# EAGLE board LARIX_V5.1 (EAGLE 6.5.0)
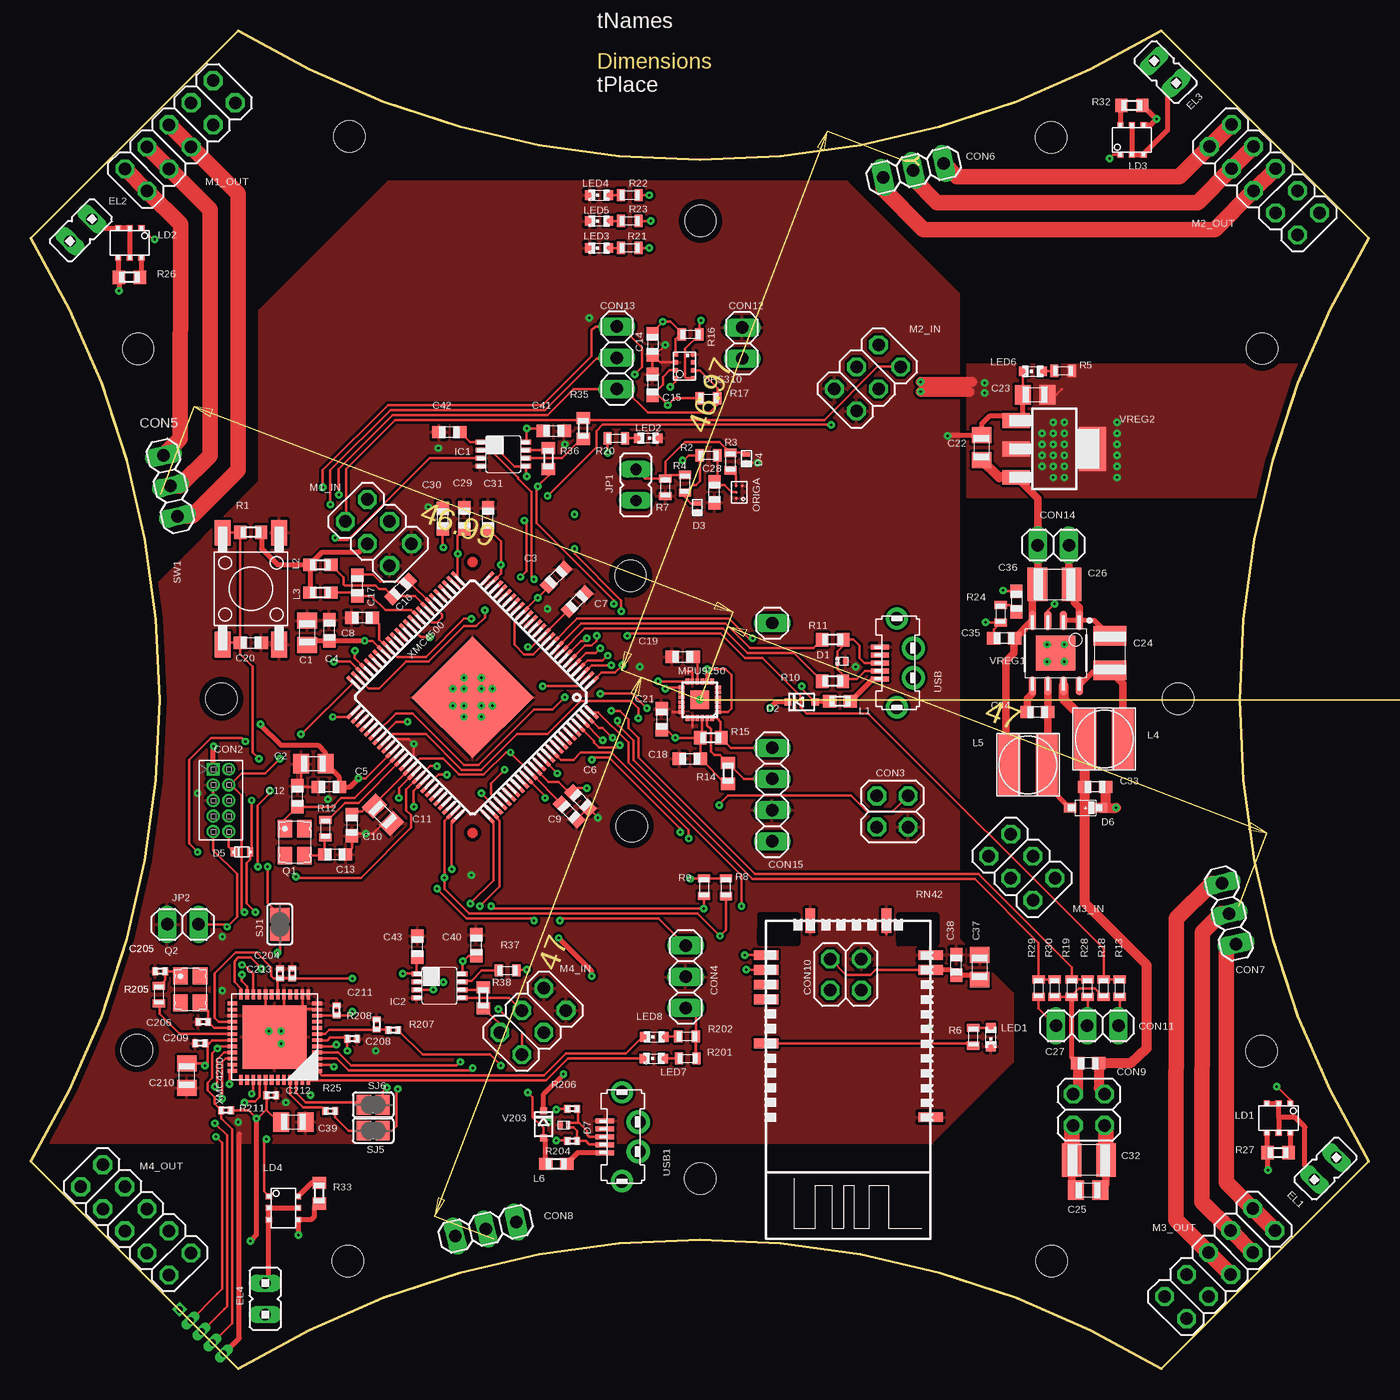
[diagram p3: board, top side]
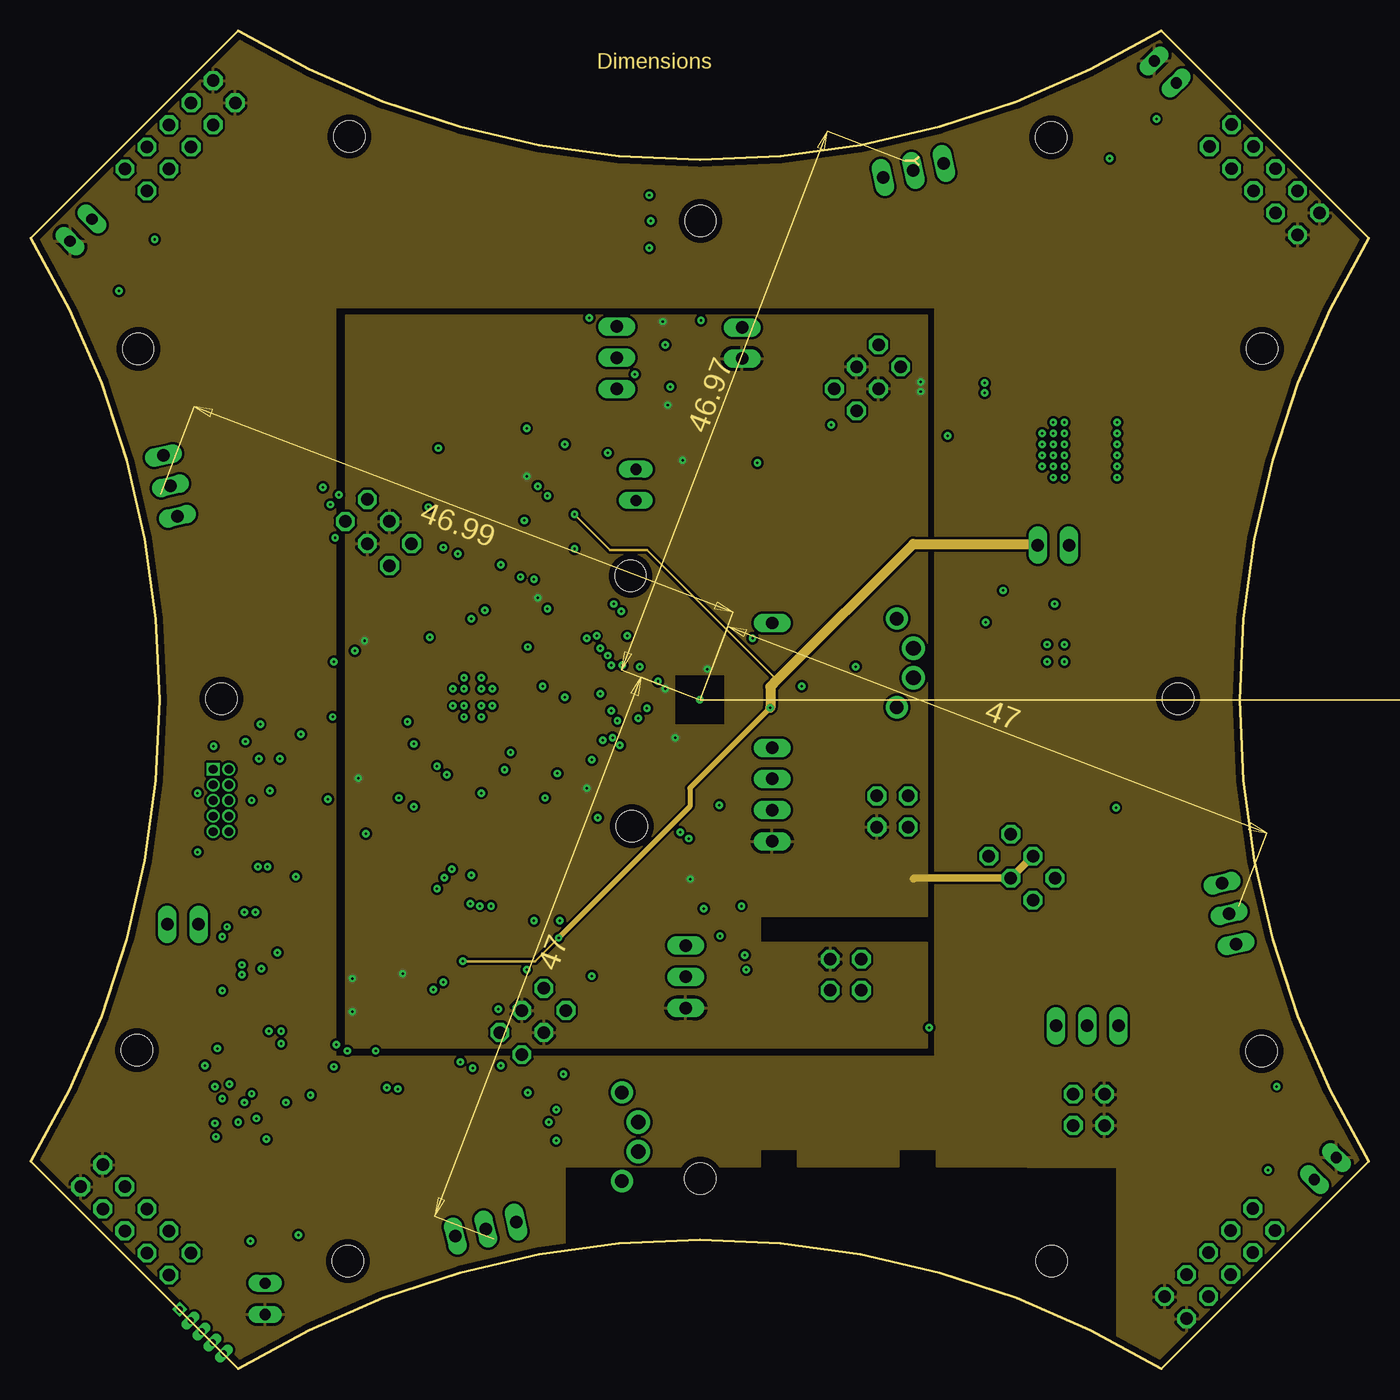
[diagram p4: board, inner layer VCC_VDD]
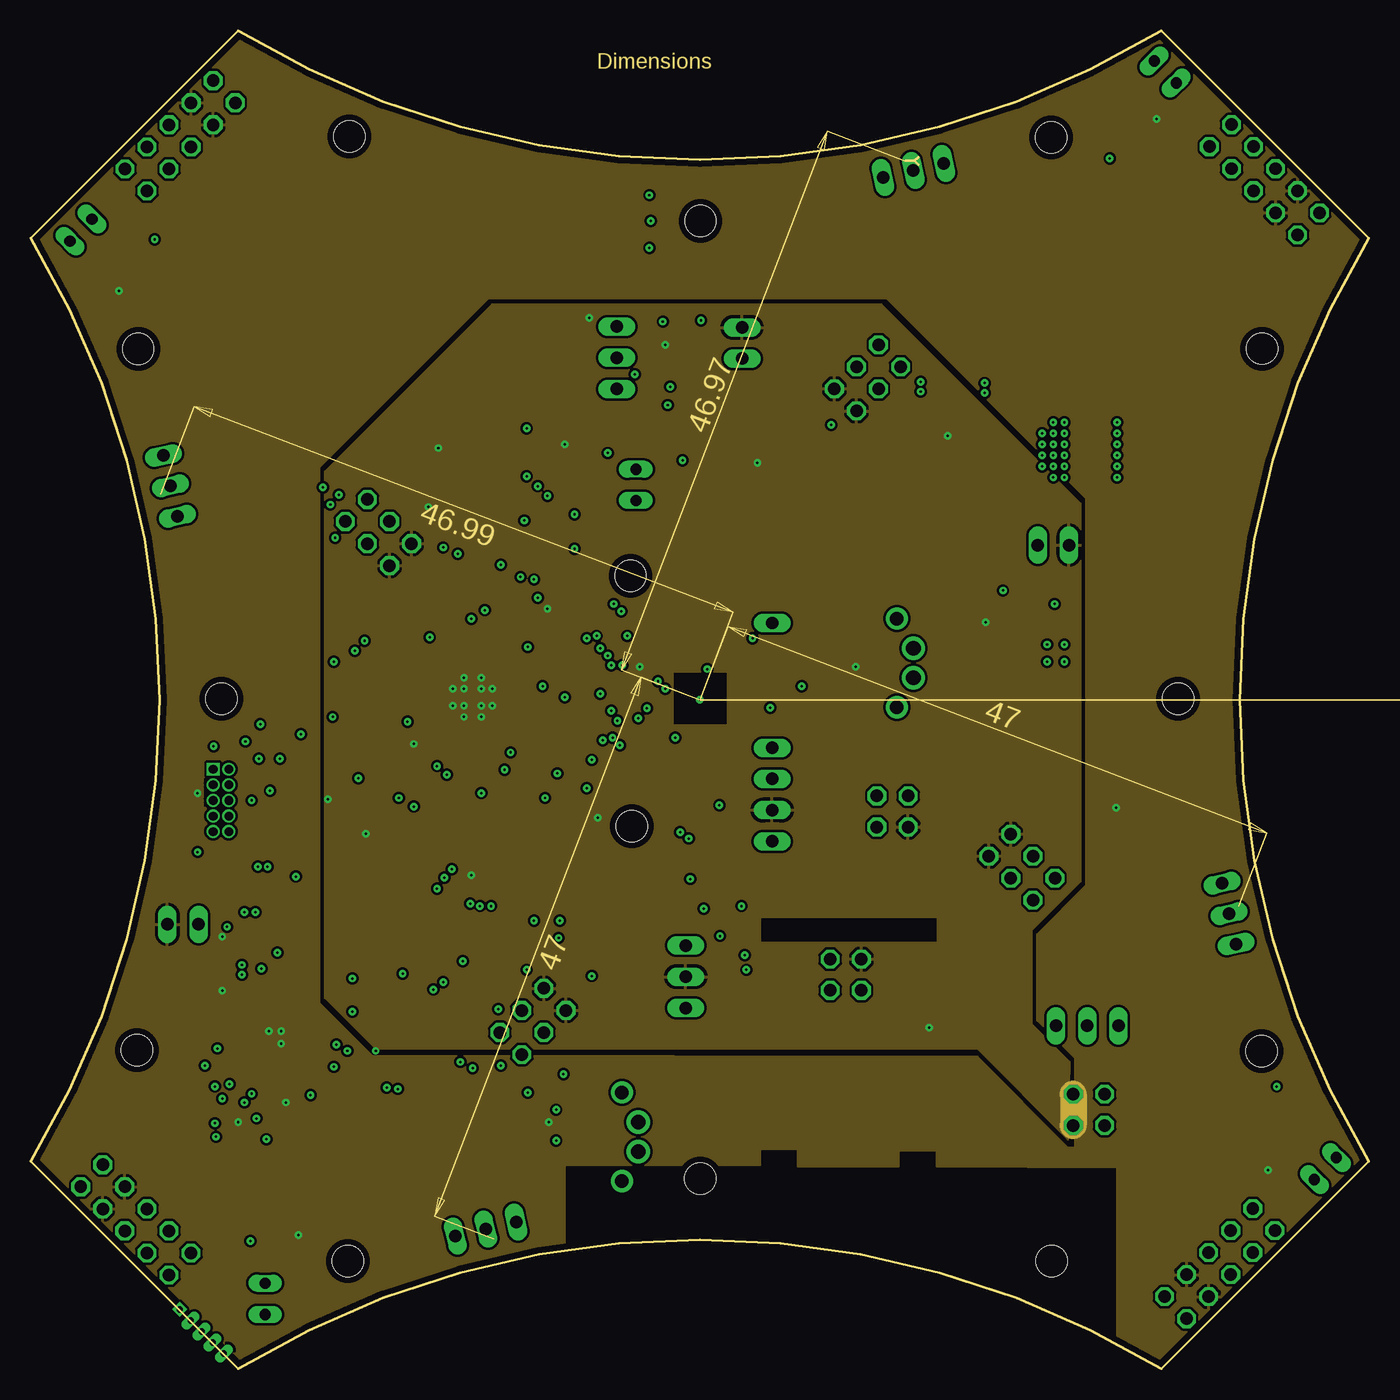
[diagram p5: board, inner layer PGND_DGND]
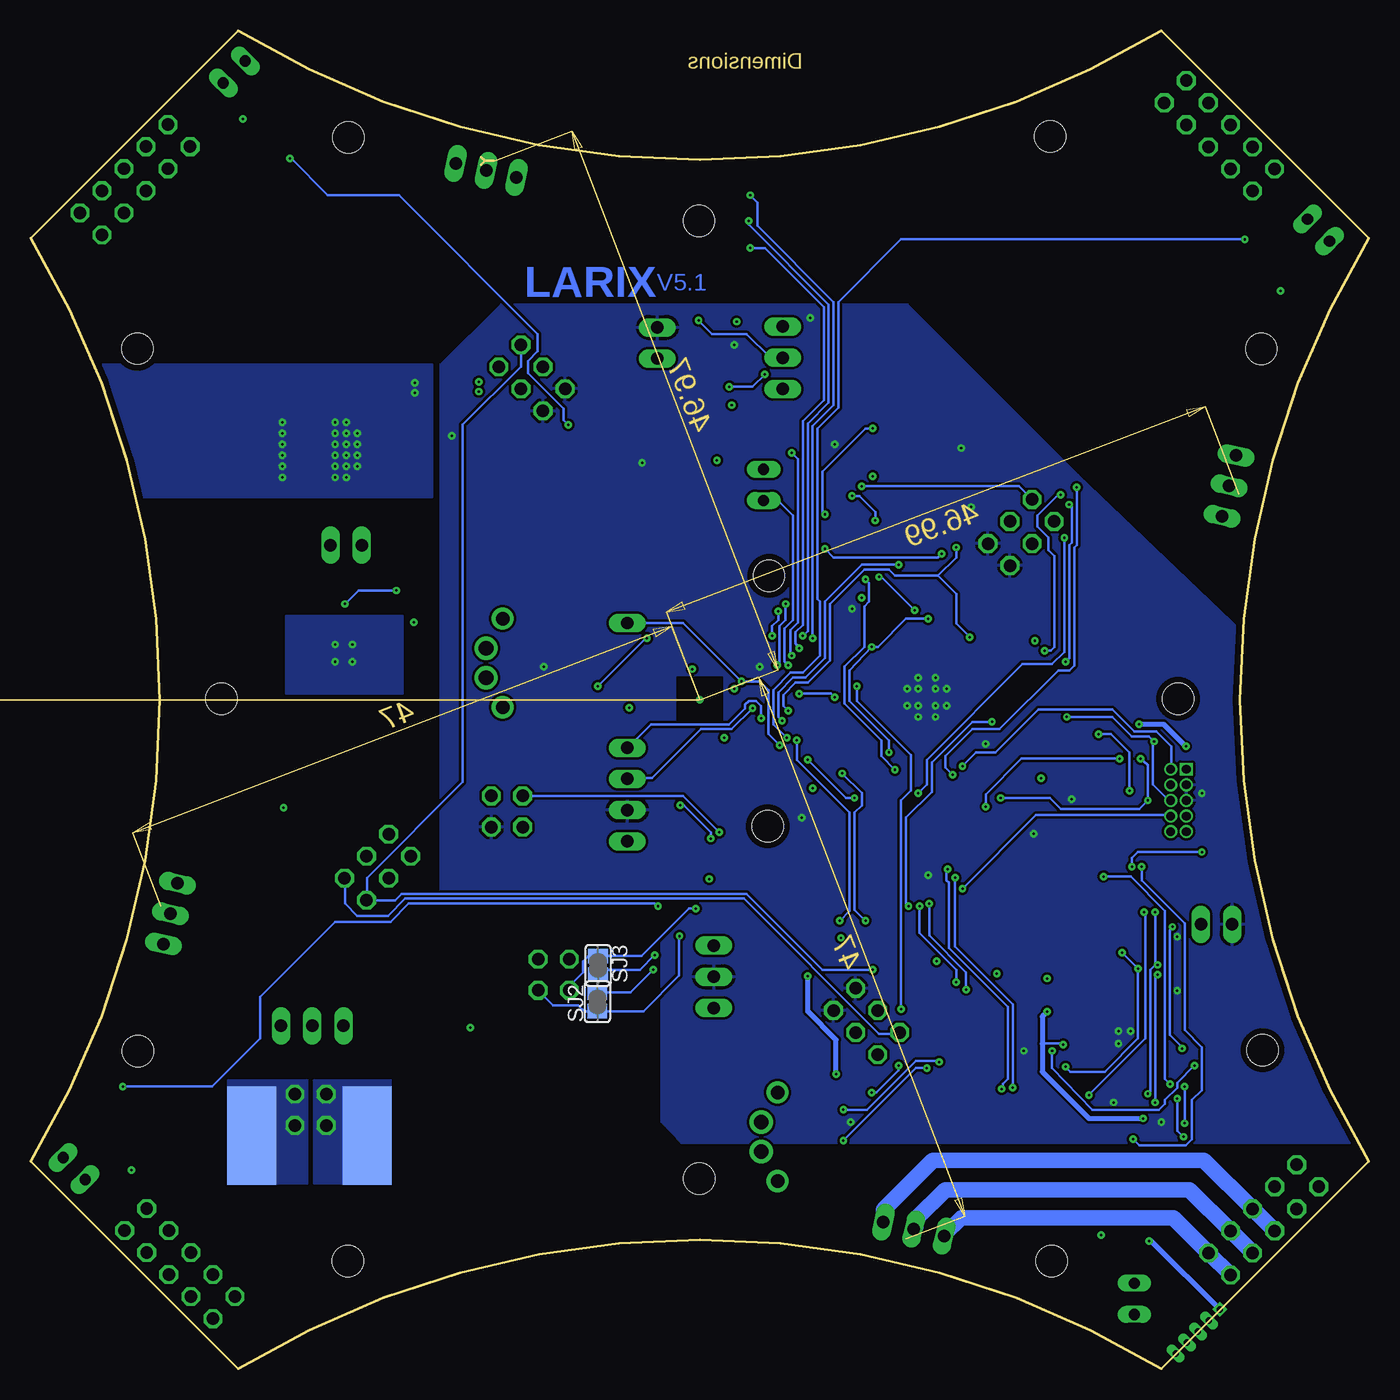
[diagram p6: board, bottom side, seen from below]

Size 109 x 109 mm. Coordinates in mm from the lower left corner, seen from the top.
Outline: 16.9,109 arc62 92.1,109 109,92.1 arc62 109,16.9 92.1,0 arc62 16.9,0 0,16.9 arc62 0,92.1 16.9,109
Copper layers (1+2*15+16): Top 0.035mm / dielectric 0.4mm / VCC_VDD 0.035mm / dielectric 0.71mm / PGND_DGND 0.035mm / dielectric 0.4mm / Bottom 0.035mm
Design rules "Hitzex_CPU_45A *": minimum track width 0.2mm, minimum drill 0.2mm, track to track 0.2mm, track to pad 0.2mm, pad to pad 0.2mm, via to via 0.2mm, smd to smd 0.2mm, copper to edge 0.5mm, drill to drill 0.5mm, minimum pad ring 7mil, minimum via ring 0.2mm, stop-mask expansion 4mil, vias tented up to drill 0.2mm, thermal gap 10mil
Holes 2.54 mm at 48.96,44.19 48.86,64.59 25.96,100.39 8.76,83.09 8.65,25.97 25.85,8.77 100.32,83.1 83.12,100.3 83.15,8.78 100.25,25.88 93.45,54.58 54.55,15.48 15.55,54.57 54.56,93.49
tRestrict: 8 lines
bRestrict: 4 lines
Milling: area 48.9,54.8 to 49.7,56.3; area 32.9,12.4 to 33.7,13.9; area 41.2,32.3 to 43.8,35.5; area 56.8,59.7 to 58.3,60.5; area 99.2,43.7 to 100.7,44.5; area 77.6,51.9 to 80.8,54.6; area 55.7,61.6 to 57.2,62.5; area 13.3,77.6 to 14.8,78.4; area 31.3,66.7 to 38.4,70.9; area 48.1,56.9 to 49,58.4; area 64.1,99.3 to 64.9,100.8; area 53.3,75.8 to 57.4,82.9; 19 lines

## Footprints (pad centres in the part's own frame; a part is rotated, then mirrored left to right if it is on the bottom)
C0805K = smd 1.3 x 1.6: 1 -1,0; 2 1,0
C0603 = smd 1.1 x 1: 1 -0.85,0; 2 0.85,0
C1210 = smd 1.6 x 2.7: 1 -1.4,0; 2 1.4,0
C0402 = smd 0.5 x 0.65: 1 -0.4,0; 2 0.4,0
FTSH-105-01-F-D-K = drill 0.7 pad 1.05 square: 1 -2.54,-0.635 | drill 0.7 pad 1.05: 2 -2.54,0.635; 3 -1.27,-0.635; 4 -1.27,0.635; 5 0,-0.635; 6 0,0.635; 7 1.27,-0.635; 8 1.27,0.635; 9 2.54,-0.635; 10 2.54,0.635
2X02 = drill 1.016 octagon: 1 -1.27,-1.27; 2 -1.27,1.27; 3 1.27,-1.27; 4 1.27,1.27
1X03 = drill 1.016 long: 1 -2.54,0; 2 0,0; 3 2.54,0
1X02 = drill 1.016 long: 1 -1.27,0; 2 1.27,0
1X10 = drill 1.016 long: 1 -11.43,0; 2 -8.89,0; 3 -6.35,0; 4 -3.81,0; 8 6.35,0
TSLP-3-1 = smd 0.225 x 0.35: 1 0.113,-0.475; 2 0.487,-0.475 | smd 0.6 x 0.35: 3 0.3,0.175
SOD323-R = smd 0.6 x 0.6: A 1.1,0; C -1.1,0
TSLP-2-20 = smd 0.6 x 0.35: P$1 0.1,0.4; P$2 0.1,-0.3
SC79 = smd 0.508 x 0.762: 1 -0.675,0; 2 0.675,0
INF-SOD323_V_1PRIMARY = smd 0.762 x 1.016: 1 0,1.25; 2 0,-1.25
LGA8R125P0X4_500X300X120 = smd 0.381 x 0.381: P1 0.725,0.975; P2 0.725,0.325; P3 0.725,-0.325; P4 0.725,-0.975; P5 -0.725,-0.975; P6 -0.725,-0.325; P7 -0.725,0.325; P8 -0.725,0.975
JP1 = drill 0.914 long: 1 0,-1.27; 2 0,1.27
DCT_R-PDSO-G8 = smd 0.4 x 0.8: 1 -0.975,-1.875; 2 -0.325,-1.875; 3 0.325,-1.875; 4 0.975,-1.875; 5 0.975,1.875; 6 0.325,1.875; 7 -0.325,1.875; 8 -0.975,1.875
L1608 = smd 1.1 x 1: 1 -0.85,0; 2 0.85,0
WE-TPC = smd 5.08 x 1.778: P$1 0,1.27; P$2 0,-1.778
SC74 = smd 0.5 x 0.5: P_1 -0.05,-2.2; P_2 0.9,-2.2; P_3 1.85,-2.2; P_4 1.85,0.2; P_5 0.9,0.2; P_6 -0.05,0.2
CHIPLED_0603 = smd 0.8 x 0.8: A 0,-0.75; C 0,0.75
2X03 = drill 1.016 octagon: 1 -2.54,-1.27; 2 -2.54,1.27; 3 0,-1.27; 4 0,1.27; 5 2.54,-1.27; 6 2.54,1.27
2X05 = drill 1.016 octagon: 1 -5.08,-1.27; 2 -5.08,1.27; 3 -2.54,-1.27; 4 -2.54,1.27; 5 0,-1.27; 6 0,1.27; 7 2.54,-1.27; 8 2.54,1.27; 9 5.08,-1.27; 10 5.08,1.27
QFN3X3-24+ = smd 0.5 x 0.3: 1 -1.5,0.996; 2 -1.5,0.596; 3 -1.5,0.196; 4 -1.5,-0.204; 5 -1.5,-0.604; 6 -1.5,-1.004; 13 1.5,-0.996; 14 1.5,-0.596; 15 1.5,-0.196; 16 1.5,0.204; 17 1.5,0.596; 18 1.5,1.004 | smd 0.3 x 0.5: 7 -0.996,-1.5; 8 -0.596,-1.5; 9 -0.196,-1.5; 10 0.204,-1.5; 11 0.604,-1.5; 12 1.004,-1.5; 19 0.996,1.5; 20 0.596,1.5; 21 0.196,1.5; 22 -0.204,1.5; 23 -0.604,1.5; 24 -1.004,1.5 | smd 1.5 x 1.5: EXP 0,0
WLB-5 = smd 0.25 x 0.25: A1 -0.19,-0.27; A2 -0.19,0.23; B2 0.31,0.23; C1 0.81,-0.27; C2 0.81,0.23
BATT-SOLDER = smd 4 x 8: P$1 0,0
32X25_4PAD = smd 1.4 x 1.2: 1 -1.1,-0.8; 2 1.1,-0.8; 3 1.1,0.8; 4 -1.1,0.8
R0603 = smd 1 x 1.1: 1 -0.85,0; 2 0.85,0
R0603' = smd 0.67 x 1: 1 -0.715,0; 2 0.715,0
R0402 = smd 0.5 x 0.65: 1 -0.4,0; 2 0.4,0
RN42+SHIELD = smd 2 x 0.8: GND1 0,16; GND2 0,2.8; GPIO_2 13.4,10; UART_CTX 13.4,6.4; UART_RTX 13.4,5.2; UART_RX 13.4,2.8; UART_TX 13.4,4; VDD 0,4 | smd 0.8 x 2: GND3 3.6,0; GND4 9.8,0
SJ = smd 1.168 x 1.6: 1 -0.762,0; 2 0.762,0
FSM2JSMA = smd 2.1 x 1.3: P -4.55,-2.3; P1 4.55,-2.3; S -4.55,2.3; S1 4.55,2.3
PINHEAD_127 = drill 0.508 square: P$1 0,0 | drill 0.508 long: P$2 0,-1.27; P$3 0,-2.54; P$4 0,-3.81; P$5 0,-5.08
USBVERTICAL = smd 0.4 x 1.5: 1 1.3,2.72; 2 0.65,2.72; 3+ 0,2.72; 4 -0.65,2.72; 5 -1.3,2.72 | drill 1.2 pad 1.9: P$1 1.2,0; P$2 -1.2,0 | drill 1.1 pad 1.8: P$3 -3.61,1.34; P$4 3.61,1.34
INF-PG-DSO-8-27_N_1PRIMARY = smd 1.55 x 0.6: 1 -2.65,1.905; 2 -2.65,0.635; 3 -2.65,-0.635; 4 -2.65,-1.905; 5 2.65,-1.905; 6 2.65,-0.635; 7 2.65,0.635; 8 2.65,1.905 | smd 2.85 x 3.2: 9 0,0
SOT223 = smd 1.219 x 2.235: 1 -2.311,-3.099; 2 0,-3.099; 3 2.311,-3.099 | smd 3.6 x 2.2: 4 0,3.099
QFN-48-7X7 = smd 0.8 x 0.3: 1 -3.45,2.75; 2 -3.45,2.25; 3 -3.45,1.75; 4 -3.45,1.25; 5 -3.45,0.75; 6 -3.45,0.25; 7 -3.45,-0.25; 8 -3.45,-0.75; 9 -3.45,-1.25; 10 -3.45,-1.75; 11 -3.45,-2.25; 12 -3.45,-2.75; 25 3.45,-2.75; 26 3.45,-2.25; 27 3.45,-1.75; 28 3.45,-1.25; 29 3.45,-0.75; 30 3.45,-0.25; 31 3.45,0.25; 32 3.45,0.75; 33 3.45,1.25; 34 3.45,1.75; 35 3.45,2.25; 36 3.45,2.75 | smd 0.3 x 0.8: 13 -2.75,-3.475; 14 -2.25,-3.475; 15 -1.75,-3.475; 16 -1.25,-3.475; 17 -0.75,-3.475; 18 -0.25,-3.475; 19 0.25,-3.475; 20 0.75,-3.475; 21 1.25,-3.475; 22 1.75,-3.475; 23 2.25,-3.475; 24 2.75,-3.475; 37 2.75,3.475; 38 2.25,3.475; 39 1.75,3.475; 40 1.25,3.475; 41 0.75,3.475; 42 0.25,3.475; 43 -0.25,3.475; 44 -0.75,3.475; 45 -1.25,3.475; 46 -1.75,3.475; 47 -2.25,3.475; 48 -2.75,3.475 | smd 5.2 x 5.2: EPAD 0,0
P/PG-LQFP-100-11 = smd 1.35 x 0.29: 1 -7.725,6; 2 -7.725,5.5; 3 -7.725,5; 4 -7.725,4.5; 5 -7.725,4; 6 -7.725,3.5; 7 -7.725,3; 8 -7.725,2.5; 9 -7.725,2; 10 -7.725,1.5; 11 -7.725,1; 12 -7.725,0.5; 13 -7.725,0; 14 -7.725,-0.5; 15 -7.725,-1; 16 -7.725,-1.5; 17 -7.725,-2; 18 -7.725,-2.5; 19 -7.725,-3; 20 -7.725,-3.5; 21 -7.725,-4; 22 -7.725,-4.5; 23 -7.725,-5; 24 -7.725,-5.5; 25 -7.725,-6; 51 7.725,-6; 52 7.725,-5.5; 53 7.725,-5; 54 7.725,-4.5; 55 7.725,-4; 56 7.725,-3.5; 57 7.725,-3; 58 7.725,-2.5; 59 7.725,-2; 60 7.725,-1.5; 61 7.725,-1; 62 7.725,-0.5; 63 7.725,0; 64 7.725,0.5; 65 7.725,1; 66 7.725,1.5; 67 7.725,2; 68 7.725,2.5; 69 7.725,3; 70 7.725,3.5; 71 7.725,4; 72 7.725,4.5; 73 7.725,5; 74 7.725,5.5; 75 7.725,6 | smd 0.29 x 1.35: 26 -6,-7.725; 27 -5.5,-7.725; 28 -5,-7.725; 29 -4.5,-7.725; 30 -4,-7.725; 31 -3.5,-7.725; 32 -3,-7.725; 33 -2.5,-7.725; 34 -2,-7.725; 35 -1.5,-7.725; 36 -1,-7.725; 37 -0.5,-7.725; 38 0,-7.725; 39 0.5,-7.725; 40 1,-7.725; 41 1.5,-7.725; 42 2,-7.725; 43 2.5,-7.725; 44 3,-7.725; 45 3.5,-7.725; 46 4,-7.725; 47 4.5,-7.725; 48 5,-7.725; 49 5.5,-7.725; 50 6,-7.725; 76 6,7.725; 77 5.5,7.725; 78 5,7.725; 79 4.5,7.725; 80 4,7.725; 81 3.5,7.725; 82 3,7.725; 83 2.5,7.725; 84 2,7.725; 85 1.5,7.725; 86 1,7.725; 87 0.5,7.725; 88 0,7.725; 89 -0.5,7.725; 90 -1,7.725; 91 -1.5,7.725; 92 -2,7.725; 93 -2.5,7.725; 94 -3,7.725; 95 -3.5,7.725; 96 -4,7.725; 97 -4.5,7.725; 98 -5,7.725; 99 -5.5,7.725; 100 -6,7.725 | smd 7 x 7: EXP 0,0

## Placement (x,y rotation side)
C1  10µ  [C0805K]  22.52,59.94 90 top
C2  10µ  [C0805K]  23.02,49.29 180 top
C3  100n  [C0603]  42.8,64.5 45 top
C4  100n  [C0603]  24.33,60.15 90 top
C5  100n  [C0603]  24.3,47.4 180 top
C6  100n  [C0603]  44.8,46.3 315 top
C7  100n  [C0603]  44.5,62.5 45 top
C8  100n  [C0603]  27,61.18 180 top
C9  100n  [C0603]  43.86,45.36 315 top
C10  100n  [C0603]  26.17,44.27 270 top
C11  10µ  [C0805K]  28.69,45.13 315 top
C12  15p  [C0603]  21.73,46.63 90 top
C13  15p  [C0603]  24.8,41.9 0 top
C14  100n  [C0603]  50.65,83.46 270 top
C15  100n  [C0603]  50.65,80.16 270 top
C16  100n  [C0603]  30.13,63.53 45 top
C17  100n  [C0603]  26.6,63.8 90 top
C18  100n  [C0603]  53.7,49.7 0 top
C19  100n  [C0603]  53.1,58 0 top
C20  10n  [C0603]  17.93,59.15 0 top
C21  10n  [C0603]  51.4,52.9 270 top
C22  10µ  [C0805K]  77.46,75.04 90 top
C23  10µ  [C0805K]  81.82,79.34 180 top
C24  100µ  [C1210]  87.9,58.3 270 top
C25  10µ  [C0805K]  86.14,14.55 180 top
C26  100µ  [C1210]  83.4,63.9 0 top
C27  100n  [C0603]  86.14,24.89 180 top
C28  100n  [C0603]  55.7,71.4 90 top
C29  n.m.  [C0603]  35.32,69.27 90 top
C30  n.m.  [C0603]  33.57,69.26 90 top
C31  n.m.  [C0603]  37.26,69.27 90 top
C32  100µ  [C1210]  86.2,17 180 top
C33  220n  [C0603]  86.7,47.4 180 top
C34  220n  [C0603]  82,53.5 180 top
C35  220n  [C0603]  79.3,59.5 180 top
C36  22n  [C0603]  80.3,62.5 270 top
C37  10u  [C0805K]  77.3,32.7 90 top
C38  100n  [C0603]  75.4,32.9 90 top
C39  10µ  [C0805K]  21.4,20.1 0 top
C40  100n  [C0603]  36.3,34.5 90 top
C41  100n  [C0603]  42.6,76.4 0 top
C42  100n  [C0603]  34.1,76.3 180 top
C43  100n  [C0603]  31.5,34.4 90 top
C204  100n  [C0402]  21.3,32.23 90 top
C205  15p  [C0402]  10.55,32.38 180 top
C206  15p  [C0402]  14.05,28.26 180 top
C208  100n  [C0402]  26.2,26.89 0 top
C209  100n  [C0402]  13.81,26.52 180 top
C210  4.7µ  [C0805K]  12.71,23.88 270 top
C211  100n  [C0402]  24.92,29.21 90 top
C212  100n  [C0402]  19.6,22.29 0 top
C213  100n  [C0402]  20.3,32.2 90 top
CON2  FTSH-105-01-F-D-K  [FTSH-105-01-F-D-K]  15.5,46.3 270 top
CON3  [2X02]  70.2,45.4 90 top
CON4  [1X03]  53.36,31.94 90 top
CON5  [1X03]  11.38,71.92 103 top
CON6  [1X03]  71.9,97.62 13 top
CON7  [1X03]  97.61,37.08 283 top
CON8  [1X03]  37.07,11.39 193 top
CON9  [2X02]  86.2,21.1 270 top
CON10  [2X02]  66.4,32.1 180 top
CON11  [1X03]  86.07,27.94 180 top
CON12  [1X02]  57.95,83.56 90 top
CON13  [1X03]  47.75,82.36 90 top
CON14  [1X02]  83.3,67.1 0 top
CON15  [1X10]  60.4,54.4 90 top
D1  ESD8V0L2B-03L  [TSLP-3-1]  66.21,57.95 270 top
D2  BAT60A  [SOD323-R]  62.79,54.32 0 top
D3  ESD218-B1-02EL  [TSLP-2-20]  54.4,70.2 180 top
D4  ESD218-B1-02EL  [TSLP-2-20]  58.4,74.2 180 top
D5  BAT54-02V  [SC79]  17.2,42.1 0 top
D6  BAS21-03W  [INF-SOD323_V_1PRIMARY]  85.9,45.7 270 top
D7  ESD8V0L2B-03L  [TSLP-3-1]  43.31,19.55 90 top
DPS310  Infineon  [LGA8R125P0X4_500X300X120]  53.25,81.66 0 top
EL1  [JP1]  105.46,16.31 135 top
EL2  [JP1]  4.1,92.76 315 top
EL3  [JP1]  92.42,105.64 225 top
EL4  [JP1]  19.1,5.7 0 top
IC1  SN74LVC2T45DCT  [DCT_R-PDSO-G8]  38.5,74.5 270 top
IC2  SN74LVC2T45DCT  [DCT_R-PDSO-G8]  33.3,31.2 270 top
JP1  [JP1]  49.3,72 180 top
JP2  [1X02]  12.4,36.2 180 top
L1  BLM18PG600  [L1608]  65.92,54.38 0 top
L2  BLM18PG600  [L1608]  23.6,65.5 180 top
L3  BLM18PG600  [L1608]  23.61,63.23 180 top
L4  47µH  [WE-TPC]  87.7,51.3 270 top
L5  47µH  [WE-TPC]  81.5,49.2 270 top
L6  BLM18PG600  [L1608]  42.8,16.7 180 top
LD1  BCU321  [SC74]  102.55,19.41 180 top
LD2  BCU321  [SC74]  8.97,90.72 180 top
LD3  BCU321  [SC74]  88.8,101.1 0 top
LD4  BCU321  [SC74]  21.6,14 270 top
LED1  n.m.  [CHIPLED_0603]  78.22,27.01 180 top
LED2  LED-GREEN/D/0603  [CHIPLED_0603]  50.3,75.8 270 top
LED3  LED-RED/D/0603  [CHIPLED_0603]  46.3,91.3 90 top
LED4  LED-GREEN/D/0603  [CHIPLED_0603]  46.3,95.6 90 top
LED5  LED-YELLOW/D/0603  [CHIPLED_0603]  46.3,93.5 90 top
LED6  LED-BLUE/D/0603  [CHIPLED_0603]  81.63,81.25 90 top
LED7  LED-GREEN/D/0603  [CHIPLED_0603]  50.76,25.27 90 top
LED8  LED-RED/D/0603  [CHIPLED_0603]  50.8,27.03 90 top
M1_IN  [2X03]  28.33,68.12 135 top
M1_OUT  [2X05]  12.17,100.44 45 top
M2_IN  [2X03]  68.16,80.72 45 top
M2_OUT  [2X05]  100.51,96.86 315 top
M3_IN  [2X03]  80.74,40.86 315 top
M3_OUT  [2X05]  96.86,8.57 225 top
M4_IN  [2X03]  40.91,28.3 225 top
M4_OUT  [2X05]  8.56,12.13 135 top
MPU9250  MPU9250  [QFN3X3-24+]  54.5,54.5 180 top
ORIGA  ORIGA2L  [WLB-5]  57.7,71.1 90 top
PAD1  PAD-BATTERY  [BATT-SOLDER]  91,19 0 bottom
PAD2  PAD-BATTERY  [BATT-SOLDER]  81.6,19 0 bottom
Q1  12MHZ/S/3.2X2.5  [32X25_4PAD]  21.5,42.9 270 top
Q2  12MHZ/S/3.2X2.5  [32X25_4PAD]  13,30.9 270 top
R1  10k  [R0603]  17.93,68.15 0 top
R2  20R  [R0603']  55.22,74.4 0 top
R3  25R  [R0603']  57,73.9 90 top
R4  1k  [R0603']  53.3,72.1 90 top
R5  680R  [R0603']  84.1,81.29 0 top
R6  n.m.  [R0603']  76.78,27.05 270 top
R7  330k  [R0603']  51.7,71.8 270 top
R8  4k7  [R0603']  56.63,39.22 270 top
R9  4k7  [R0603']  54.85,39.23 270 top
R10  22R  [R0603]  65.31,56.03 180 top
R11  22R  [R0603]  65.33,59.41 180 top
R12  510R  [R0603']  24,44 270 top
R13  30k  [R0603']  88.7,31 90 top
R14  4.7k  [R0603]  56.8,48.5 270 top
R15  4.7k  [R0603]  55.4,51.4 180 top
R16  1k  [R0603']  53.75,84.26 0 top
R17  1k  [R0603']  55.22,79.06 0 top
R18  10k  [R0603']  87.4,31 270 top
R19  10k  [R0603']  84.8,31 270 top
R20  680R  [R0603']  47.7,75.8 180 top
R21  680R  [R0603']  48.8,91.3 0 top
R22  680R  [R0603']  48.8,95.6 0 top
R23  680R  [R0603']  48.8,93.5 0 top
R24  22k  [R0603']  79,61.5 270 top
R25  510R  [R0402]  24.4,21 0 top
R26  n.m.  [R0603]  8.05,88.92 180 top
R27  n.m.  [R0603]  101.6,17.62 180 top
R28  30k  [R0603']  86.1,31 90 top
R29  30k  [R0603']  82.1,31 90 top
R30  10k  [R0603']  83.4,31 270 top
R32  n.m.  [R0603]  89.7,102.9 0 top
R33  n.m.  [R0603]  23.5,14.3 270 top
R35  n.m.  [R0603]  45,76.6 270 top
R36  n.m.  [R0603]  42.18,74.15 90 top
R37  n.m.  [R0603']  38.85,32.45 180 top
R38  n.m.  [R0603]  36.87,30.21 90 top
R201  680R  [R0603']  53.52,25.28 180 top
R202  680R  [R0603']  53.46,27.08 180 top
R204  22R  [R0402]  44.11,18.56 0 top
R205  510R  [R0603']  10.45,30.48 90 top
R206  22R  [R0402]  44.11,21.18 0 top
R207  4.7k  [R0402]  29.54,27.59 0 top
R208  10k  [R0402]  28.19,28.05 270 top
R211  10k  [R0402]  15.91,21.06 0 top
RN42  n.m.  [RN42+SHIELD]  73.3,36.5 180 top
SJ1  [SJ]  20.3,36.2 90 top
SJ2  [SJ]  62.84,29.89 90 bottom
SJ3  [SJ]  62.79,32.86 270 bottom
SJ5  [SJ]  27.9,19.4 180 top
SJ6  [SJ]  27.9,21.5 180 top
SW1  TMPS2-SMD  [FSM2JSMA]  17.93,63.55 270 top
U$9  127MARKED  [PINHEAD_127]  12.13,4.83 45 top
U$11  SEGGER.L_100  [LOGO_100]  26.4,23.5 0 top
USB  vertical  [USBVERTICAL]  71.9,57.5 90 top
USB1  vertical  [USBVERTICAL]  49.5,18.9 90 top
V203  BAT60A  [SOD323-R]  41.78,19.92 270 top
VREG1  IFX91041V50  [INF-PG-DSO-8-27_N_1PRIMARY]  83.5,58.3 270 top
VREG2  IFX1117MEV33  [SOT223]  83.38,74.93 270 top
XMC4200  XMC4200_QFN48  [QFN-48-7X7]  19.88,27.02 180 top
XMC4500  XMC4500_LQFP100  [P/PG-LQFP-100-11]  35.99,54.69 225 top

## Tracks (layer width: path | path; a pad name or v marks a point on that pad's centre or on a via)
AGND
  Top 0.2: C17.2 26.65,64.7 27.9,64.7 28.47,64.13 C16.2 30.8,64.13 XMC4500.32 33.5,61.43 33.5,61.2 33.1,60.8 32.71,60.8 XMC4500.34
AUX_LED#
  Top 0.2: LED8.C 49.83,27.03 48.5,25.7 43.6,25.7 41.8,23.9 23.7,23.9 XMC4200.1
COOLING  (via drill 0.2)
  Top 0.2: v84.2,57.6 VREG1.9
  other vias: 84.2,59 82.8,59 82.8,57.6
  pour Bottom: 78.7,61.3 88.2,61.3 88.2,55 78.7,55
CS  (via drill 0.2)
  Top 0.2: XMC4200.40 18.63,22.13 18.3,21.8 17.5,21.8 v17.4,21.7 | XMC4200.23 17.63,31.17 17.2,31.6 v17.2,32.1
  Bottom 0.2: v17.4,21.7 17.4,31.9 v17.2,32.1
DBGPRES#  (via drill 0.2)
  Top 0.2: 15.47,21.03 R211.1 | U$9.P$4 14.84,2.13 16.4,3.7 16.4,19.5 15.5,20.4 R211.1 | CON2.9 14.87,42.23 16.8,40.3 16.8,36.8 v16,36 15.8,36.2 JP2.1 | XMC4200.32 15.37,26.27 v15.2,26.1 14.8,25.7 14.8,23.7 14.4,23.3 14.4,22.7 15,22.1 15,21.56 R211.1
  Bottom 0.2: v15.2,26.1 15.2,26.2 16.2,27.2 16.2,35.7 v16,36
DEBUG_LED#
  Top 0.2: LED7.C 43.77,25.27 42,23.5 22.68,23.5 XMC4200.48
DEBUG_RX_XMC42/TX_XMC45
  Top 0.2: XMC4200.46 21.63,22.47 22.4,21.7 26.94,21.7 SJ6.2
DEBUG_TX_XMC42/RX_XMC45
  Top 0.2: R25.2 24.8,20.5 25.9,19.4 SJ5.2
GND  (via drill 0.2)
  Top 0.2: C14.2 C15.1 | DPS310.P7 51.27,81.98 C14.2 | RN42.GND4 RN42.GND3 69.7,35.44 | R30.2 R19.2 84.8,30.4 85.4,31 86.69,31 R18.2 | 100.7,17.87 R27.2 | LED6.C 80.82,81.21 C23.2 | C2.2 22.02,47.77 C12.2 21.81,47.4 C5.2 23.45,47.15 | C14.2 50.91,82.61 v51.7,83.4 | D4.P$1 v59.2,73.8 | C9.2 C6.2 45.5,45.6 v46.2,44.9 | C10.2 26.32,43.22 | XMC4500.63 31.2,49.9 v31.2,50.9 30.8,51.3 29.77,51.3 XMC4500.59 | XMC4500.EXP v35.3,54 | C30.2 33.5,70.18 v32.4,70.2 | CON2.3 CON2.5 | C13.2 26.17,42.42 C10.2 | C10.2 26.35,43.6 v27.3,43.6 27.9,43.6 28.72,44.42 C11.2 | C35.2 78.45,60.23 R24.2 77.81,60.78 v77.8,60.8 | MPU9250.20 53.9,52.3 | MPU9250.18 52.3,53.5 | MPU9250.11 53.9,56.7 53.8,56.8 53.4,56.8 53.3,56.9 | U$9.P$5 15.74,1.24 | XMC4200.20 19.13,27.77 XMC4200.EPAD | XMC4200.17 20.63,27.77 XMC4200.EPAD | R32.2 90.65,103.1 | XMC4200.EPAD 22.13,29.27 22.23,29.27 | 22.23,29.27 22.13,29.37 XMC4200.14 | 22.23,29.27 22.26,29.3 23.4,29.3
  Top 0.406: 85.23,24.13 C27.2 84.8,25.38 R19.2 | R27.2 100.75,16.35 v100.8,16.2 | LD1.P_4 100.7,17.87 | C23.2 80.82,77.78 VREG2.1 79.92,77.6 78.1,77.6 77.46,76.96 C22.2 77.42,76 v74.7,76 | v7.2,87.8 R26.2 7.12,89 LD2.P_4 | C24.1 86.65,60.95 VREG1.1 VREG1.2 | 87.55,46.1 D6.1 | 15.74,1.24 17,2.5 17,19.11 | v21.8,10.9 LD4.P_4 22.85,12.15 23.1,12.4 23.1,13.05 R33.2 | LD3.P_4 91.2,101.3 v91.7,101.8 90.6,102.9 R32.2
  Top 0.6: CON14.2 84.57,63.73 C26.2 85,63.3 85,62.4 85.41,61.99 VREG1.1
  Top 0.61: C32.2 84.8,14.89 C25.2
  Top 0.813: C27.2 85.29,22.73 CON9.1 | C33.1 87.55,46.1 | D6.1 v88.4,45.7
  Top 1.27: C32.2 84.8,19.7 CON9.3
  PGND_DGND 2.184: CON9.1 CON9.3
  other vias: 45.5,85.6 24.2,46.4 34.4,55.4 35.3,55.4 35.3,56.3 36.7,56.3 36.7,55.4 37.6,55.4 37.6,54 36.7,54 36.7,53.1 35.3,53.1 34.4,54 49.6,57.2 73.18,27.8 67.2,57.2 42.1,61.9 16.9,20.1 35.9,40.2 15.6,30.8 20.8,21.7 28.1,25.9 42.2,20.1 15.6,35.2 13.6,46.9 43.5,75.3 33.2,75 19.4,27.5 20.4,27.5 20.4,26.5
  pour PGND_DGND: 77.1,26.1 73.8,26.1 73.9,36.8 59.4,36.8 59.4,34.7 73.8,34.7 73.7,26.1 28.1,26.1 24,30.2 24,54.2 52.3,54.2 52.3,52.4 56.8,52.4 56.8,56.8 52.3,56.8 52.3,54.3 24,54.3 24,73.1 37.6,86.7 69.3,86.7 85.5,70.5 85.5,39.7 81.5,35.7 81.5,28.1 84.6,25 84.5,18.7
  pour PGND_DGND: 16.9,109 21.2,106.6 28.4,103.4 35.3,101 42.1,99.5 51.4,98.6 55.3,98.5 55.3,87.2 37.3,87.2 23.5,73.4 23.5,29.8 27.8,25.5 77.1,25.4 84.5,18 85.1,18 85.1,25.3 82,28.4 82,35.4 86,39.4 86,70.9 69.7,87.2 55.4,87.2 55.4,98.5 59,98.7 67.4,99.7 74.6,101.4 83.5,104.5 89.8,107.7 92.1,109 109,92.1 106.4,87.4 104.4,83 102.5,78.4 100.6,72.1 99.2,64.8 98.5,57.5 98.6,52.6 99.1,44.6 101,35.8 103.9,26.7 107.5,19.4 109.1,16.8 92,-0.1 88.5,1.8 88.5,16.4 73.8,16.5 73.8,17.8 70.7,17.8 70.7,16.5 62.5,16.5 62.5,17.9 59.4,17.9 59.4,16.6 43.5,16.6 43.5,9.6 40.6,9.1 31.2,6.5 26.1,4.5 20.1,1.7 16.9,-0.1 0,16.9 3.2,22.8 6,29.2 8.2,36.6 9.8,44.2 10.1,46.8 14,46.8 14,45.7 15.5,45.7 15.5,48.2 14,48.2 14,46.9 10.1,46.9 10.4,50.6 10.5,56.7 9.5,66.7 7.4,75.6 4.8,82.8 1.6,89.3 0,92.2
  pour Top: 29.1,96.7 66.5,96.7 75.6,87.6 75.6,35 80,30.6 80,25 73.4,18.4 0.8,18.4 3.9,24.2 6.9,31.9 9,39.8 9.2,41 9.6,43 9.8,44.7 10.3,49.2 10.5,53.7 10.4,59 10.2,61.1 10,62.9 9.9,63.5 12.6,66.2 18.6,72.3 18.6,86.2
  pour Bottom (no thermals): 85.9,23.5 79.7,23.5 79.7,15.1 85.9,15.1
  pour Bottom: 37.6,86.7 70.7,86.7 75.6,81.8 75.6,37.5 57.6,37.5 57.6,20.1 56,18.4 0.9,18.4 4.4,25.3 6.1,29.6 7,32.1 9.5,42.6 10.5,52.2 10.3,60 23.7,72.8
LEDOUT1
  Top 0.406: 101.65,20.5 LD1.P_5 | EL1.2 104.56,15.74 103.8,16.5 103.8,19.7 103,20.5 101.65,20.5 | LD1.P_3 LD1.P_2 101.65,20.5
LEDOUT2
  Top 0.406: EL2.2 5.73,92.92 LD2.P_3 LD2.P_2 LD2.P_5
LEDOUT3
  Top 0.406: EL4.2 19.4,7.27 LD4.P_3 LD4.P_2 LD4.P_5
LEDOUT4
  Top 0.406: LD3.P_5 LD3.P_2 LD3.P_3 90.65,98.95 92.6,100.9 92.6,104.03 EL3.2
N$1
  Top 0.2: R20.1 LED2.A
N$2
  Top 0.2: ORIGA.B2 57.09,71.41 56.5,72 55.95,72 C28.2 55.52,72.44 55.93,72.85 R2.2
N$3
  Top 0.2: LED3.A R21.1
N$4  (via drill 0.2)
  Top 0.2: C36.1 79.25,63.35 v79.2,63.4 | VREG1.3 82.86,61.77 v83.4,62.3
  Bottom 0.2: v83.4,62.3 82.3,63.4 v79.2,63.4
N$6
  Top 0.2: XMC4500.62 26.69,46.1 25.6,46.1 24.21,44.72 R12.1
N$7
  Top 0.2: Q1.3 23.85,41.8 C13.1 23.95,43.23 R12.2
N$8
  Top 0.2: Q1.1 20.7,44.75 C12.1 24.58,45.78 25.3,46.5 26.39,46.5 XMC4500.61
N$9
  Top 0.2: R4.2 52,72.81 R7.1 | R7.1 50.05,72.52 JP1.1 | D4.P$2 58.19,74.61 R3.2 56.12,75.5 53.3,75.5 51.7,73.9 R7.1
N$10
  Top 0.2: D7.1 44.23,19.66 44.5,19.4 R204.2 45.24,18.56 45.5,18.3 46.73,18.3 USB1.4
N$11
  Top 0.406: USB.5 68.6,56.2 L1.2
N$12
  Top 0.2: ORIGA.C2 57.47,72.72 R3.1
N$13
  Top 0.2: 66.03,56.46 R10.1 | USB.4 67.95,56.85 67.3,56.2 66.34,56.2 R10.1 | D1.2 65.73,56.97 66.2,56.5 66.2,56.06 R10.1
N$14
  Top 1.27: M1_OUT.6 M1_OUT.5 16.9,95.71 16.9,73.2 13.15,69.45 CON5.1
N$15
  Top 0.2: LED6.A 82.42,81.29 R5.1
N$16  (via drill 0.2)
  Top 0.2: R37.1 39.62,32.5 v40.4,32.5
  Bottom 0.2: M2_IN.6 69.06,81.64 73.8,76.9 73.8,47.8 81.6,40 81.6,38.21 M3_IN.5 79.33,38.17 78.8,38.7 50.7,38.7 44.5,32.5 v40.4,32.5
N$17
  Top 0.2: C36.2 79.73,62.22 R24.1
N$18
  Top 0.2: R6.1 LED1.A
N$19
  Top 0.2: 16.12,43.75 CON2.10 16.13,42.49 D5.1
N$20
  Top 0.2: MPU9250.10 54.3,57.5 53.8,58 C19.2
N$21
  Top 1.27: M1_OUT.4 M1_OUT.3 14.6,94.41 14.6,74.4 12.11,71.91 CON5.2
N$22
  Top 0.2: LED4.A R22.1
N$23  (via drill 0.2)
  other vias: 54.5,54.5
N$24
  Top 0.2: R23.1 LED5.A
N$25
  Top 1.27: M1_OUT.2 M1_OUT.1 12.2,93.22 12.19,75.78 CON5.3
N$26
  Top 0.2: RN42.GPIO_2 76.61,26.5 R6.2
N$27
  Top 0.2: RN42.UART_RTX RN42.UART_CTX
N$28
  Top 0.406: VREG1.8 86.56,56.8 C24.2
  Top 0.61: L4.P$1 88.97,55.83 C24.2
N$29
  Top 0.2: USB1.3+ 45.5,18.9 45.3,19.1 45.3,19.4 44.66,20.04 D7.2 44.54,20.04 44.6,20.1 44.6,21.09 R206.2
N$30
  Top 0.2: 82.85,49.51 82.77,49.43 L5.P$1 82.77,47.58 82.88,47.47
  Top 0.406: 82.86,53.52 C34.1 | D6.2 82.88,47.47
  Top 0.6: VREG1.6 82.86,53.52 | C34.1 82.85,49.51
N$31
  Top 0.406: LD2.P_6 9.02,89.04 R26.1
N$32
  Top 0.2: Q2.1 11.82,32.38 C205.1 10.95,31.7 R205.2
N$33
  Top 0.2: 102.6,17.97 R27.1
  Top 0.406: LD1.P_6 102.6,17.97
N$34
  Top 0.2: XMC4200.30 12.13,27.27 10.5,28.9 10.5,29.71 R205.1
N$35
  Top 1.27: M2_OUT.6 M2_OUT.5 96.45,92.8 72.73,92.8 69.43,96.12 CON6.1
N$36
  Top 0.2: USB.3+ 67.9,57.5 67.5,57.9 67.5,58.9 67,59.4 R11.1 66.2,59.38 66.2,58.9 65.73,58.44 D1.1
N$37
  Top 0.2: R13.1 88.7,28.03 CON11.1
N$38
  Top 1.27: M2_OUT.2 M2_OUT.1 93.56,97.1 75.46,97.11 CON6.3
N$39  (via drill 0.2)
  Top 0.2: R207.2 31.92,25.6 37.4,25.6 v38.3,24.7 | v40.5,22.5 40.9,22.1 40.9,20.5 41.78,19.62 V203.A
  Top 0.406: L6.2 41.95,18.65 V203.A
  Bottom 0.2: v38.3,24.7 38.3,24.3 40.1,22.5 v40.5,22.5
N$40
  Top 1.27: M2_OUT.4 M2_OUT.3 95.06,95 73.83,95 71.9,96.93 CON6.2
N$41
  Top 0.2: R28.1 86.1,27.97 CON11.2
N$42
  Bottom 1.27: CON8.1 39.55,12.95 35.5,17 13.43,17 M4_OUT.5 M4_OUT.6
N$43
  Top 0.2: R29.1 82.1,29.37 CON11.3
N$44
  Top 0.2: XMC4200.29 14.94,27.77 C206.1 14.45,29.15 Q2.3
N$45
  Bottom 1.27: M4_OUT.2 M4_OUT.1 15.92,12.3 33.2,12.3 34.6,10.9 CON8.3
N$46
  Bottom 1.27: M4_OUT.4 M4_OUT.3 14.62,14.6 34.5,14.6 36.9,12.2 36.9,11.56 CON8.2
N$47
  Top 0.6: VREG1.5 81.59,54.99 81.2,54.6 81.2,53.55 C34.2
N$48
  Top 0.2: R201.2 LED7.A
N$49
  Top 1.27: M3_OUT.6 M3_OUT.5 93.3,12.13 93.31,36.67 96.19,39.55 CON7.1
N$50
  Top 1.27: M3_OUT.4 M3_OUT.3 95.4,13.62 95.43,35.54 96.97,37.08 CON7.2
N$51
  Top 0.2: R25.1 23.7,21.3 22.2,21.3 21.13,22.37 XMC4200.45
N$52
  Top 0.2: R207.1 29.07,27.65 R208.2 28.14,27.6 24.3,27.6 23.97,27.27 XMC4200.7
N$53
  Top 1.27: M3_OUT.2 M3_OUT.1 99.59,13.01 97.4,15.2 97.4,34.4 97.6,34.6 CON7.3
N$54
  Top 0.2: R38.1 38.21,28.15 M4_IN.5
  Bottom 0.2: M4_IN.5 38.31,27.3 39.9,27.3 50.9,38.3 78.5,38.3 79.9,36.9 82.4,36.9 83.4,37.9 83.4,39.93 M3_IN.6
N$55
  Top 0.2: 25.55,69.1 M1_IN.6 25.7,69.08 25.7,73.3 29.7,77.3 45,77.3 | M2_IN.5 68.98,81.62 64.66,77.3 45,77.3 | R35.1 45,77.3
N$56
  Top 0.2: R202.2 51.6,27.08 LED8.A
N$59
  Top 0.2: R32.1 88.75,103.1
  Top 0.406: 88.75,103.1 LD3.P_6
N$60
  Top 0.406: LD4.P_6 22.9,15.15 R33.1
N$61  (via drill 0.2)
  Top 0.2: v58.3,32.5 RN42.UART_TX
  Bottom 0.2: SJ2.2 60.15,30.65 v58.3,32.5
N$62  (via drill 0.2)
  Top 0.2: RN42.UART_RX v58.17,33.7
  Bottom 0.2: SJ3.2 62.39,32.5 59.37,32.5 v58.17,33.7
P0.0  (via drill 0.2)
  Top 0.2: M4_IN.6 40.01,27.39 v38.1,29.3 | XMC4500.2 44.68,55.6 v41.7,55.6
  Bottom 0.2: v41.7,55.6 41.7,54.4 37.3,50 37.3,47.1 38.1,46.3 v38.1,29.3
P0.1  (via drill 0.2)
  Top 0.2: R36.1 42.18,72.78 v41.3,71.9 41.2,71.8 41.2,68.9 47.5,62.6 v47.5,62.3 | XMC4500.1 46.48,56.7 47.6,56.7 v48.2,57.3
  Bottom 0.2: M1_IN.5 28.52,71.9 v41.3,71.9 | v48.2,57.3 48,57.5 48,60.5 47.5,61 v47.5,62.3
P0.2  (via drill 0.2)
  Top 0.2: XMC4500.100 46.23,53.47 48.7,51 48.7,49.4 57.9,40.2 v57.9,37.7 | LD1.P_1 102.6,21.9 v101.5,23
  Bottom 0.2: v57.9,37.7 58.2,37.9 78.2,37.9 79.7,36.4 84.2,36.4 90.3,30.3 90.3,26.9 94.2,23 v101.5,23
P0.3  (via drill 0.2)
  Top 0.2: v47.4,51.4 46.6,52.2 46.3,52.2 45.38,53.12 XMC4500.99 | LD2.P_1 9.94,92 v10.1,92
  Bottom 0.2: v10.1,92 38.1,92 43.2,86.9 43.2,78.3 44.9,76.6 44.9,62.7 44.7,62.5 44.7,58.1 46.1,56.7 47.1,56.7 48.5,55.3 48.5,52.5 v47.4,51.4
P0.4  (via drill 0.2)
  Top 0.2: XMC4500.98 46.56,51.2 v46.6,51.2 | CON4.3 51.14,36.7 43.3,36.7 v43.1,36.5
  Bottom 0.2: v43.1,36.5 42.3,37.3 42.3,45.3 46.6,49.6 v46.6,51.2
P0.5  (via drill 0.2)
  Top 0.2: v48,50.8 47.8,50.6 46.3,50.6 45.9,51 45.9,51.15 XMC4500.97 | MPU9250.12 v51.1,56
  Bottom 0.2: v48,50.8 48.9,51.7 48.9,55.3 49.6,56 v51.1,56 55.85,60.75 CON15.8
P0.7  (via drill 0.2)
  Top 0.2: XMC4500.89 v42.9,48.5 | v41,36.5 40.8,36.7 35.5,36.7 v33.1,39.1
  Bottom 0.2: v42.9,48.5 41.3,46.9 41.3,45.9 41.9,45.3 41.9,37.4 v41,36.5 | CON2.8 16.2,45.1 27.1,45.1 v33.1,39.1
P0.9  (via drill 0.2)
  Top 0.2: XMC4500.4 45.36,57.7 46.6,57.7 v47,58.1 | v47,74.6 47,75.78 R20.2
  Bottom 0.2: v47,58.1 47.1,58.2 47.1,60.2 46.5,60.8 46.5,74.1 v47,74.6
P0.10  (via drill 0.2)
  Top 0.2: XMC4500.3 45.67,57.3 v47.3,57.3
  Bottom 0.2: v47.3,57.3 47.6,57.6 47.6,60.3 46.9,61 46.9,69.5 48.2,70.8 49.23,70.8 JP1.2
P1.0  (via drill 0.2)
  Top 0.2: IC1.2 37.48,74.83 39.7,72.6 39.7,72.5 40.8,71.4 40.8,64.5 v41,64.3 | XMC4500.79 37.5,46.82 37.5,47.7 v38.6,48.8
  Bottom 0.2: v38.6,48.8 39.7,49.9 39.7,51.2 42.7,54.2 42.7,57.2 41.1,58.8 41.1,62.1 40.7,62.5 40.7,64 v41,64.3
P1.1  (via drill 0.2)
  Top 0.2: XMC4500.78 37.91,45.7 v36.7,46.9 | IC1.3 32.48,74.17 25.8,67.5 25,67.5 v24.8,67.7
  Bottom 0.2: v24.8,67.7 24.8,58.4 25.8,57.4 28.2,57.4 36,49.6 36,47.6 v36.7,46.9
P1.2  (via drill 0.2)
  Top 0.2: XMC4500.77 38.2,44.61 38.2,39.3 v36.6,37.7 | v33.6,31.5 31.45,31.5 IC2.2
  Bottom 0.2: v36.6,37.7 36.6,35.5 33.6,32.5 v33.6,31.5
P1.3  (via drill 0.2)
  Top 0.2: XMC4500.76 37.7,44.5 37.7,39.8 v35.8,37.9 | v32.8,30.9 32.77,30.88 IC2.3
  Bottom 0.2: v35.8,37.9 35.8,35.3 32.8,32.3 v32.8,30.9
P1.4  (via drill 0.2)
  Top 0.2: SJ5.1 29.4,19.4 29.8,19.8 29.8,22.7 v29.9,22.8 | v34.3,40.7 34.3,44.52 XMC4500.75
  Bottom 0.2: v34.3,40.7 34.4,40.6 34.4,39.8 34.2,39.6 34.2,34.3 29.4,29.5 29.4,23.6 29.8,23.2 29.8,22.9 v29.9,22.8
P1.5  (via drill 0.2)
  Top 0.2: XMC4500.74 33.7,44.62 v33.7,40 33.7,39.1 35.7,37.1 54.31,37.1 v56.15,35.26 56.63,35.74 R8.2 | SJ6.1 28.66,22.56 v29,22.9
  Bottom 0.2: v56.15,35.26 56.19,35.22 56.19,32.03 59.09,29.13 SJ2.1 62.87,29.1 63.9,29.1 64.4,29.6 66.44,29.6 CON10.2 | v29,22.9 29,29.7 33.7,34.4 v33.7,40
P1.15  (via drill 0.2)
  Top 0.2: DPS310.P5 52.52,80.42 v52.1,80 | XMC4500.68 33.24,48.4 v33.9,48.4 | v49.2,81 49.8,81.6 49.8,83.2 48.1,84.9 CON13.3 46,84.9 45.7,84.6 45.7,82.5 41.7,78.5 29.1,78.5 23.8,73.2 v23.8,71.8
  Bottom 0.2: v52.1,80 50.2,80 v49.2,81 | v33.9,48.4 34.5,49 34.5,49.9 32.3,52.1 30.1,52.1 25.3,56.9 24.4,56.9 24,57.3 24,66.9 23.8,67.1 v23.8,71.8
P2.2  (via drill 0.2)
  Top 0.2: XMC4500.50 22.08,51.7 v22,51.7 | v19.5,47.1 19.5,46.9 18.5,45.9 v18.5,40.9 | LD4.P_1 19,14.45 19,18.5 v19.2,18.7
  Bottom 0.2: v22,51.7 21,51.7 19.5,50.2 v19.5,47.1 | v18.5,40.9 18.5,39.8 15,36.3 15,27.6 13.6,26.2 13.6,22.7 14.4,21.9 14.4,18.7 14.9,18.2 18.7,18.2 v19.2,18.7
P2.3  (via drill 0.2)
  Top 0.2: XMC4500.49 27.51,55.4 28.4,55.4 30.6,57.6 32.4,57.6 35.3,60.5 36.3,60.5 37,61.2 v37,61.8 | v39.9,64.5 40.4,65 40.4,68.9 v40.2,69.1 | v42.1,71.1 46.1,75.1 46.1,76.4 46.6,76.9 v65.2,76.9 | v87.9,98.6 88.2,98.9 LD3.P_1
  Bottom 0.2: v37,61.8 39.7,64.5 v39.9,64.5 | v40.2,69.1 40.2,69.8 41.5,71.1 v42.1,71.1 | v65.2,76.9 65.6,77.3 65.6,78.2 68.5,81.1 68.5,82.1 67.7,82.9 67.7,84.3 79,95.6 84.8,95.6 87.8,98.6 v87.9,98.6
P2.4  (via drill 0.2)
  Top 0.2: DPS310.P4 53.41,80.69 53.3,80.8 53.3,83.09 R16.2 54.47,85.27 v54.6,85.4 | XMC4500.48 26.9,56.72 26,57.6 v24.7,57.6 | v24.4,70.4 24.4,73.2 29.3,78.1 41.9,78.1 46.1,82.3 47.69,82.3 CON13.2
  Bottom 0.2: v54.6,85.4 53.5,84.3 50.7,84.3 48.8,82.4 47.79,82.4 CON13.2 | v24.4,70.4 24.2,70.2 24.2,67.3 24.4,67.1 24.4,57.9 v24.7,57.6
P2.5  (via drill 0.2)
  Top 0.2: DPS310.P3 54.01,81.3 54.5,81.3 55.93,79.87 R17.2 55.93,78.53 55.3,77.9 50.27,77.9 48.35,79.82 CON13.1 46.4,79.82 | v26.4,58.5 26.4,57.9 27.33,56.97 XMC4500.47 | v25.1,71.2 25.1,73.3 29.5,77.7 42.1,77.7 44.2,79.8 46.38,79.8 46.4,79.82 | 46.4,79.82 45.92,79.82
  Bottom 0.2: v25.1,71.2 25.3,71.2 27,69.5 27,68.6 26.1,67.7 26.1,66.7 25.6,66.2 25.6,58.8 25.9,58.5 v26.4,58.5
P3.0  (via drill 0.2)
  Top 0.2: v50.4,95.6 R22.2 | v45.3,59.5 45.1,59.3 44.84,59.3 XMC4500.7
  Bottom 0.2: v45.3,59.5 45.3,76.8 43.6,78.5 43.6,86.9 49.8,93.1 49.8,95 v50.4,95.6
P3.1  (via drill 0.2)
  Top 0.2: XMC4500.6 45.15,58.9 45.7,58.9 46.1,59.3 v46.1,59.7 | v50.5,93.5 R23.2
  Bottom 0.2: v46.1,59.7 45.7,60.1 45.7,77 44,78.7 44,86.7 50.5,93.2 v50.5,93.5
P3.2  (via drill 0.2)
  Top 0.2: XMC4500.5 45.26,58.3 46,58.3 v46.4,58.7 | v50.4,91.3 R21.2
  Bottom 0.2: v46.4,58.7 46.7,59.1 46.7,60 46.1,60.6 46.1,77.2 44.4,78.9 44.4,86.5 49.2,91.3 v50.4,91.3
P3.5  (via drill 0.2)
  Top 0.2: XMC4500.91 43.21,49.6 44.2,49.6 44.8,50.2 47.3,50.2 53.6,43.9 v53.6,43.2 | CON3.3 70.2,45.4 68.1,45.4 66.8,46.7 56.8,46.7 56.1,46 v56.1,45.9
  Bottom 0.2: v53.6,43.2 53.6,43.7 55.8,45.9 v56.1,45.9
P4.0  (via drill 0.2)
  Top 0.2: XMC4500.85 41.9,46.66 v41.9,46.5 | v45.7,49.6 45.9,49.8 47.1,49.8 52.9,44 v52.9,43.7
  Bottom 0.2: v41.9,46.5 42.6,46.5 v45.7,49.6 | v52.9,43.7 55.87,46.67 CON3.4
P5.0  (via drill 0.2)
  Top 0.2: MPU9250.24 55.9,53 56.2,52.7 56.2,51.45 R15.1 57.06,50.59 CON15.4 | XMC4500.58 29.46,51.7 32.2,51.7 35.1,48.8 36.7,48.8 39.6,51.7 42.1,51.7 44.8,54.4 48.9,54.4 49.5,53.8 v49.5,53
  Bottom 0.2: v49.5,53 49.5,54 49.9,54.4 50.5,54.4 50.8,54.1 50.8,53.8 52.1,52.5 58.49,52.5 CON15.4
P5.1  (via drill 0.2)
  Top 0.2: v30.7,52.7 29.76,52.7 XMC4500.57 | v37.5,37.7 37.7,37.5 v54.81,37.5 v54.82,37.49 54.85,37.52 R9.2
  Bottom 0.2: v37.5,37.7 37.7,37.9 37.7,44.9 35.6,47 35.6,49.4 32.3,52.7 v30.7,52.7 | v54.82,37.49 55.39,37.49 59.26,33.62 SJ3.1 | 62.9,33.83 SJ3.1 | CON10.4 65.13,31.17 64,32.3 64,33.2 63.6,33.6 62.81,33.6 SJ3.1
P5.2  (via drill 0.2)
  Top 0.2: MPU9250.23 55.1,52.4 55.4,52.1 55.4,50.3 55.7,50 56.15,50 R14.1 58.1,48.05 CON15.3 | XMC4500.56 29.75,53.4 31.1,53.4 35.3,49.2 36.5,49.2 41,53.7 42.5,53.7 v43.5,54.7 | v46.4,55 49,55 v50.2,53.8
  Bottom 0.2: v43.5,54.7 43.8,55 v46.4,55 | CON15.3 59.1,48.05 59.02,48.12 58.38,48.12 54.4,52.1 51.9,52.1 v50.2,53.8
P14.5  (via drill 0.2)
  Top 0.2: R13.2 R18.1 87.4,34.2 68.2,53.4 63.2,53.4 62.7,53.9 62.7,54.8 59.6,57.9 58.2,57.9 56.2,59.9 48.8,59.9 v48.6,59.7 | C29.1 34.77,67.87 XMC4500.26 34.77,66.37 v34.8,66.4 | v48.1,61.7 48.1,62.6 44.3,66.4 v44.3,66.8
  Bottom 0.2: v44.3,66.8 43.6,66.1 35.1,66.1 v34.8,66.4 | v48.1,61.7 48.1,61 48.6,60.5 v48.6,59.7
P14.7  (via drill 0.2)
  Top 0.2: R30.1 R29.2 82.1,34.7 76.9,39.9 58.8,39.9 49.1,49.6 49.1,51.2 47.8,52.5 v47.8,52.8 | C31.1 38.3,67.38 v38.3,65.5 38.3,64.8 37.57,64.07 XMC4500.24
  Bottom 0.2: v38.3,65.5 41.3,65.5 44.3,62.5 44.3,57.9 45.9,56.3 46.9,56.3 48.1,55.1 48.1,53.1 v47.8,52.8
P14.8  (via drill 0.2)
  Top 0.2: R28.2 R19.1 84.8,32.7 77.2,40.3 59,40.3 49.5,49.8 49.5,51.4 48.7,52.2 48.7,52.9 48,53.6 v47.3,53.6 | XMC4500.37 31.69,59.7 31.7,59.7 31.8,59.6 v32.5,59.6 | v33.6,66.9 33.57,66.93 C30.1
  Bottom 0.2: v47.3,53.6 47.7,54 47.7,54.9 46.7,55.9 45.7,55.9 43.9,57.7 43.9,62.3 41.1,65.1 39.1,65.1 38.6,64.6 35.1,64.6 | v32.5,59.6 33.6,60.7 33.6,63.1 35.1,64.6 | v33.6,66.9 33.6,66.1 35.1,64.6
PWM_MC1
  Top 0.2: IC1.7 42.14,74.83 R36.2
PWM_MC2
  Top 0.2: IC1.6 43.27,74.17 44.98,75.89 R35.2
PWM_MC3
  Top 0.2: IC2.7 35.25,31.6 35.9,31.6 36.75,32.45 R37.2
PWM_MC4
  Top 0.2: IC2.6 36.82,30.88 R38.2
RESET#  (via drill 0.2)
  Top 0.2: XMC4500.65 31.22,48.52 30,47.3 v30,46.5 | C20.1 17.08,58.22 18.1,57.2 18.1,50.2 v18.6,49.7 | v18,46.3 18,42.23 D5.2 17.88,41.48 17.6,41.2 17.6,37.9 v18.3,37.2 | SW1.P1 15.78,59.15 C20.1 | C20.1 R1.1 17.03,68.1 SW1.P
  Bottom 0.2: v30,46.5 26,46.5 25.1,45.6 18.7,45.6 v18,46.3 18,49.2 v18.6,49.7 | v22.8,22.3 18.2,26.9 18.2,37.1 v18.3,37.2
SWV  (via drill 0.2)
  Top 0.2: XMC4500.51 25.91,53.1 v24.6,53.1 | v17.5,51.1 17.2,51.4 14.7,51.4 12.9,49.6 12.9,42.8 v13.6,42.1 | SJ1.2 19.3,37.96 v19.3,40.9
  Bottom 0.2: v24.6,53.1 20.9,53.1 19.3,51.5 17.9,51.5 v17.5,51.1 17.6,51 17.6,47.6 16.3,46.3 CON2.6 | v13.6,42.1 18.8,42.1 19.3,41.6 v19.3,40.9
SWV_DBG  (via drill 0.2)
  Top 0.2: XMC4200.24 17.13,30.97 16.6,31.5 16.6,33.2 16.9,33.5 17.9,33.5 v18.8,32.6 | XMC4200.2 24.53,24.77 v24.7,24.6 | SJ1.1 20.3,34.1 v20.1,33.9
  Bottom 0.2: v24.7,24.6 24.3,24.2 21.5,24.2 18.8,26.9 v18.8,32.6 v20.1,33.9
TCK  (via drill 0.2)
  Top 0.2: v31.2,45.8 31.2,47.07 XMC4500.67 | v20.3,49.7 19.1,48.5 17.2,48.5 16.3,47.6 | 16.3,47.6 16.16,47.6 CON2.4 16.27,47.57 16.3,47.6 | 16.3,47.6 17.2,46.7 17.2,37.4 v17.4,37.2 | v18,22.4 18.13,22.53 XMC4200.39 | XMC4200.22 18.13,32.17 17.4,32.9 v17.2,32.9
  Bottom 0.2: v20.3,49.7 28.3,49.7 31.2,46.8 v31.2,45.8 | v17.4,37.2 17.4,33.1 v17.2,32.9 17.4,32.9 17.8,32.5 17.8,22.6 v18,22.4
TMS  (via drill 0.2)
  Top 0.2: v33.1,49.1 32.52,49.1 XMC4500.66 30.6,47.18 30.6,45.5 31,45.1 31,44.1 26.9,40 21.7,40 v21.6,40.1 | v16.2,23.2 16.2,24.04 XMC4200.36 XMC4200.35
  Bottom 0.2: v33.1,49.1 32,50.2 30.4,50.2 26.9,53.7 20.9,53.7 19.1,51.9 17.3,51.9 16.1,50.7 16.1,48.88 CON2.2 | v16.2,23.2 16.6,23.6 16.6,37.3 19.4,40.1 v21.6,40.1
USB_D+
  Top 0.2: XMC4500.9 44.83,60.7 56.6,60.7 58.6,58.7 63.77,58.7 R11.2
USB_D-
  Top 0.2: XMC4500.8 45.14,60.3 56.4,60.3 58.4,58.3 62.19,58.3 R10.2
USBVCC
  Top 0.406: USB1.5 44.55,17.6 L6.1
VAREF
  Top 0.2: XMC4500.33 31.29,62.93 C16.1 29.47,62.93 28.9,63.5 28.4,63.5 28.1,63.8 25.6,63.8 25.5,63.9 25.5,64.45 L2.1
VBAT_IN
  Top 0.2: 85.93,52.77 85.92,52.76 L4.P$2 85.85,51.23 85.85,50.9
  Top 0.406: C27.1
  Top 0.61: C32.1 87.6,15.01 C25.1
  Top 0.813: C27.1 86.99,22.85 CON9.2 | 85.85,51.3 85.85,50.9 C33.2 85.85,37.95 90.9,32.9 90.9,26.1 89.6,24.9 C27.1 | VREG1.7 84.14,54.56 85.93,52.77
  Top 1.27: C32.1 87.6,19.7 CON9.4
  pour VCC_VDD: 109,16.9 92,-0.1 88.5,1.9 88.5,16.4 73.8,16.5 73.8,17.9 70.7,17.9 70.7,16.5 62.5,16.5 62.5,17.9 59.4,17.9 59.4,16.5 43.5,16.5 43.5,9.5 40.1,8.9 37.2,8.3 33.8,7.4 29,5.7 23.6,3.5 19.6,1.4 17,-0.1 0,16.9 1.7,19.8 4.4,25.4 6.4,30.5 8.2,36.2 9.4,41.7 10.4,49.9 10.5,57.3 9.9,64 8.7,70.9 6.8,77.3 5.8,80.1 3.6,85.6 0.9,90.6 0,92.1 16.9,109 22.8,105.8 26.6,104.1 31.4,102.2 37.2,100.6 43,99.4 48.6,98.7 52.1,98.6 55.9,98.5 61.6,98.8 66,99.4 70.1,100.2 75.5,101.6 79.8,103 82.9,104.3 87.4,106.4 90.8,108.2 92.1,109 109,92.1 106.5,87.6 104.8,84 103,79.6 101.3,74.4 100,69.2 99.1,64 73.7,64 73.7,86.5 24.8,86.5 24.8,25.4 73.7,25.4 73.7,63.9 99.1,63.9 98.5,57.3 98.6,51 98.9,46.1 99.9,40.1 101.4,34 104.1,26.6 107.1,20.2
  pour Bottom (no thermals): 86.5,23.5 92.9,23.5 92.9,15.1 86.5,15.1
VBUS  (via drill 0.2)
  Top 0.2: XMC4500.10 44.52,61.1 56.9,61.1 58.5,59.5 v58.8,59.5 | v62.8,55.6 62.8,55.41 D2.A
  Top 0.406: L1.1 63.95,54.38 D2.A
  Bottom 0.2: v58.8,59.5 59,59.4 v62.8,55.6
VDD3.3  (via drill 0.2)
  Top 0.2: C14.1 50.65,84.45 v51.5,85.3 52.1,85.3 53.03,84.36 R16.1 52.9,84.26 52.52,83.89 DPS310.P8 | RN42.VDD 68.8,32.5 68.4,32.1 66.4,32.1 CON10.3 | 84,79.8 83.54,79.34 C23.1 | 24,49.31 C2.1 | 22.78,59.3 C1.1 | 22.75,65.55 L2.2 | C3.1 42.2,63.7 v41.3,62.8 41.3,62.83 XMC4500.17 39.4,60.93 39.4,59 40.2,58.2 40.91,58.2 XMC4500.11 | C21.2 51.85,52.05 v52.5,51.4 R15.2 | L3.2 | XMC4500.43 27.85,59.3 v27.2,59.3 | 24.6,59.2 C4.1 | v26.7,48.1 27.28,48.1 XMC4500.60 | MPU9250.8 55.1,56.5 v55.1,57 56.6,57 57.1,56.5 57.1,53.8 56.8,53.5 MPU9250.1 | MPU9250.13 51.8,55.5 v51.7,55.4 | R15.2 C18.2 56.6,47.65 R14.2 | R15.2 54.55,51.55 54.7,51.7 MPU9250.22 | XMC4500.87 42.18,47.8 43,47.8 43.9,46.9 C6.1 44.6,47.3 v45.3,47.3 | DPS310.P6 52.03,81.34 51.5,80.8 51.5,80.16 C15.2 51.1,79.3 v51.9,78.5 52.46,79.06 R17.1 | R9.1 54.86,39.94 R8.1 53.77,39.94 v53.72,39.9 | D3.P$2 53.8,70.5 53.3,71 R4.1 53.91,72 54.2,72 54.5,72.3 R2.1 53.6,74.4 53.2,74 v53.1,74 | 40.35,73.5 39.4,73.5 37.42,75.47 IC1.1 35.77,75.47 C42.1 | 40.35,73.5 IC1.5 | 40.35,73.5 40.35,72.75 v40.4,72.7 | M4_IN.3 38.98,30.23 IC2.5 | v30.3,32.2 31.4,32.2 IC2.1 31.43,33.48 C43.1 | XMC4200.41 19.13,22.36 C212.1 19.2,21.11 19.19,21.1 | 20.13,31.77 XMC4200.18 20.13,31.77 | 20.13,31.77 C213.1 | C204.1 20.14,31.83 C213.1 | XMC4200.28 15.33,28.27 15,28.6 15,32.2 16.7,33.9 18.4,33.9 19.6,32.7 19.6,32 19.8,31.8 20.1,31.8 | 20.1,31.8 C213.1 | XMC4200.10 24.88,28.77 C211.1 25.91,28.81 v26.2,29.1 | 20.13,31.77 20.1,31.8 | 20.1,31.8 v26.2,31.8 | XMC4200.5 24.77,26.27 v24.9,26.4 | CON4.1 53.8,29.4 54.2,29 54.2,25.61 R201.1 54.17,25.44 R202.1 | R211.2 17.74,21.06 v18.4,20.4 18.49,20.4 19.19,21.1
  Top 0.2: C39.1 20.19,20.1 19.19,21.1
  Top 0.254: MPU9250.9 MPU9250.8 55.1,56.5
  Top 0.406: 24,49.31 24,50.2 23.4,50.8 20.4,50.8 v18.7,52.5 | C4.1 22.78,59.3 | M1_IN.4 26.71,66.5 23.7,66.5 22.75,65.55 | C2.1 25.15,48.16 C5.1 26,47.4 v26.7,48.1 | L3.2 L2.2 20.1,65.5 18.8,66.8 18.8,68.13 R1.2 | v27.2,59.3 24.8,59.3 24.6,59.2 | C37.1 76.95,32.05 C38.1 74.95,32.5 RN42.VDD | v17.9,10.4 18.4,10.9 v18.4,20.4 | CON2.1 14.87,50.66 v14.9,50.7
  Top 0.813: v72.5,80.4 76.7,80.4 | v72.5,79.6 76.5,79.6
  VCC_VDD 0.61: 71.9,39.9 72,40 72.03,39.97 M3_IN.3 M3_IN.4
  Bottom 0.2: U$9.P$1 12.13,5.03 | v24.9,26.4 25,26.5 26.6,26.5
  Bottom 0.406: v26.2,29.1 26.6,28.7 26.6,26.5 26.6,24.2 22.8,20.4 v18.4,20.4 | v17.9,10.4 17.7,10.4 U$9.P$1 | v14.9,50.7 16.7,52.5 v18.7,52.5
  other vias: 77.7,80.3 82.4,76.2 82.4,75.3 82.4,74.4 82.4,73.5 77.7,79.5 83.3,72.6 83.3,73.5 83.3,74.4 83.3,75.3 83.3,76.2 83.3,77.1 84.2,77.1 84.2,76.2 84.2,75.3 84.2,74.4 84.2,73.5 84.2,72.6 88.5,77.1 88.5,76.2 88.5,75.3 88.5,74.4 88.5,73.5 88.5,72.6
  pour Bottom: 76.3,81.8 103.7,81.8 100.4,71 76.3,71
  pour Top (no thermals): 103.8,81.8 76.3,81.8 76.3,71 100.3,71
  pour VCC_VDD: 73,85.8 73,54.4 56.6,54.4 56.6,56.6 52.4,56.6 52.4,52.4 56.6,52.4 56.6,54.3 73,54.3 73,36.9 59.4,36.9 59.4,34.7 73,34.7 73,26.2 25.7,26.2 25.7,85.8
VDD5  (via drill 0.2)
  Top 0.2: L5.P$2 79.45,49.47 79.45,49.86 | IC1.8 40.4,75.5 v40.4,76.6 41.55,76.6 C41.1 | IC2.8 35.17,33.17 v35.2,33.2 35.65,33.65 C40.1
  Top 0.406: D2.C 60.72,54.32 v60.25,53.85 | V203.C 41.78,22.38 v43.4,24 | v45.7,32 45.7,32.4 v43,35.1
  Top 0.6: 79.45,49.86 79.45,57.65 80.1,58.3 80.1,59.45 C35.1 VREG1.4 81.59,63.09 C26.1 82.03,63.53 CON14.1 82.03,70.87 VREG2.3
  Top 0.813: VREG2.3 78.88,72.62 C22.1
  VCC_VDD 0.2: v44.3,69.6 47.2,66.7 50.2,66.7 60.75,56.15 60.85,56.15 | v35.2,33.2 41.1,33.2 v43,35.1
  VCC_VDD 0.406: v60.25,53.85 53.7,47.3 53.7,45.8 v43,35.1
  VCC_VDD 0.813: CON14.1 81.93,67.2 71.9,67.2 60.85,56.15 60.25,55.55 v60.25,53.85
  Bottom 0.2: v44.3,69.6 44.5,69.8 44.5,73.1 41,76.6 v40.4,76.6
  Bottom 0.406: v43.4,24 43.4,26.8 45.7,29.1 v45.7,32
VDDA
  Top 0.2: XMC4500.35 31.01,61.8 28.9,61.8 27.75,62.95 C17.1 26.32,63.23 L3.1
VDDC  (via drill 0.2)
  Top 0.2: C8.1 28.4,60.63 28.4,59.4 29.06,58.74 XMC4500.42 29.86,58 32.2,58 35.3,61.1 v35.9,61.1 | C10.1 26.45,45.4 27,45.4 27.44,45.84 C11.1 | 27.54,45.44 C11.1 | C11.1 27.99,45.98 XMC4500.64 31.7,49.7 33.6,49.7 34.9,48.4 36.9,48.4 38.71,50.21 v39.09,50.21 39.09,50.18 XMC4500.86 43.26,46.01 C9.1 | C7.1 XMC4500.12 40.81,58.8 v40.5,58.8
  Bottom 0.2: v39.09,50.21 39.09,51.19 42.3,54.4 42.3,56.9 v40.5,58.8 40,58.8 37.7,61.1 v35.9,61.1
WTCK  (via drill 0.2)
  Top 0.2: XMC4200.34 15.87,25.27 15.6,25 v15.6,22 | U$9.P$2 15.2,6.1 15.6,6.5 15.6,18.4 v15.1,18.9
  Bottom 0.2: v15.6,22 15.6,19.4 v15.1,18.9
WTMS  (via drill 0.2)
  Top 0.2: XMC4200.33 15.77,25.77 15.2,25.2 15.2,23.2 v15,23 | v15,20 16,19 16,5.1 15.81,4.91 15.8,4.91 U$9.P$3
  Bottom 0.2: v15,23 v15,20
WUSB_DM  (via drill 0.2)
  Top 0.2: v36,24.5 35.8,24.3 25.9,24.3 24.93,25.27 XMC4200.3 | v42.8,18.6 43.67,18.6 R204.1
  Bottom 0.2: v36,24.5 36.9,24.5 v42.8,18.6
WUSB_DP  (via drill 0.2)
  Top 0.2: XMC4200.4 25.03,25.77 26.1,24.7 34.7,24.7 v35,25 | v42.8,21.1 42.88,21.18 R206.1
  Bottom 0.2: v35,25 35.1,25.1 36.9,25.1 40.9,21.1 v42.8,21.1
WVDDC  (via drill 0.2)
  Top 0.2: XMC4200.31 14.77,26.77 14.52,26.52 | 14.52,26.52 14.4,26.4 14.4,24.9 v14.2,24.7 14.02,24.88 C210.1 | XMC4200.6 24.17,26.77 24.4,27 25.69,27 C208.1 v25.8,25.9 | C209.1 14.52,26.52
  Bottom 0.2: v25.8,25.9 25.8,24.5 22.5,21.1 17.1,21.1 16.6,21.6 16.6,21.9 15.6,22.9 15.6,23.3 v14.2,24.7

## Text on the board
Top: Layer 1 TOP
Bottom: Layer 2 BOT | V5.1 | LARIX
Dimension: Dimensions
tPlace: tPlace
tNames: tNames
tValues: tValues
Measures: [mm]
Document: LD2 | D4 | D3 | USB | LD1 | Bluetooth
tSilk: TOP Silkscreen | VBAT | State1 | U V W | State2 | W V U | U V W | State3 | VBAT | FRONT | DPS310 | PMM TI COP | www.mci.edu | Origa | U V W | 5V | GND | MPU9x50 | RESET | XMC4500 | 9250 | USB | F100K1024 | P4.0 | P3.5 | 3V3 | GND | GPS | W V U | CORTEX / DEBUG | 3V3 | GND | SJ1 | RC-Control | P0.4 | BAT Safety | GND | XMC4200 / OBD | 3V3 | Bluetooth | P5.1 | P1.5 | AUX | DBG | BAT IN | VBAT | GND | SJ6 | VBAT | SJ5 | U V W | DEBUG | W V U | W V U | VBAT
bSilk: BOT Silkscreen | GND | P1.15 | 3V3 | PMM TI COP | P2.4 | www.mci.edu | P2.5 | Jumper | P0.5 | P5.0 | P5.2 | GND | 3V3 | OBD / disable | SJ3 | SJ2 | GND | BAT IN | VBAT